# EAGLE design untitled (EAGLE 9.6.2)
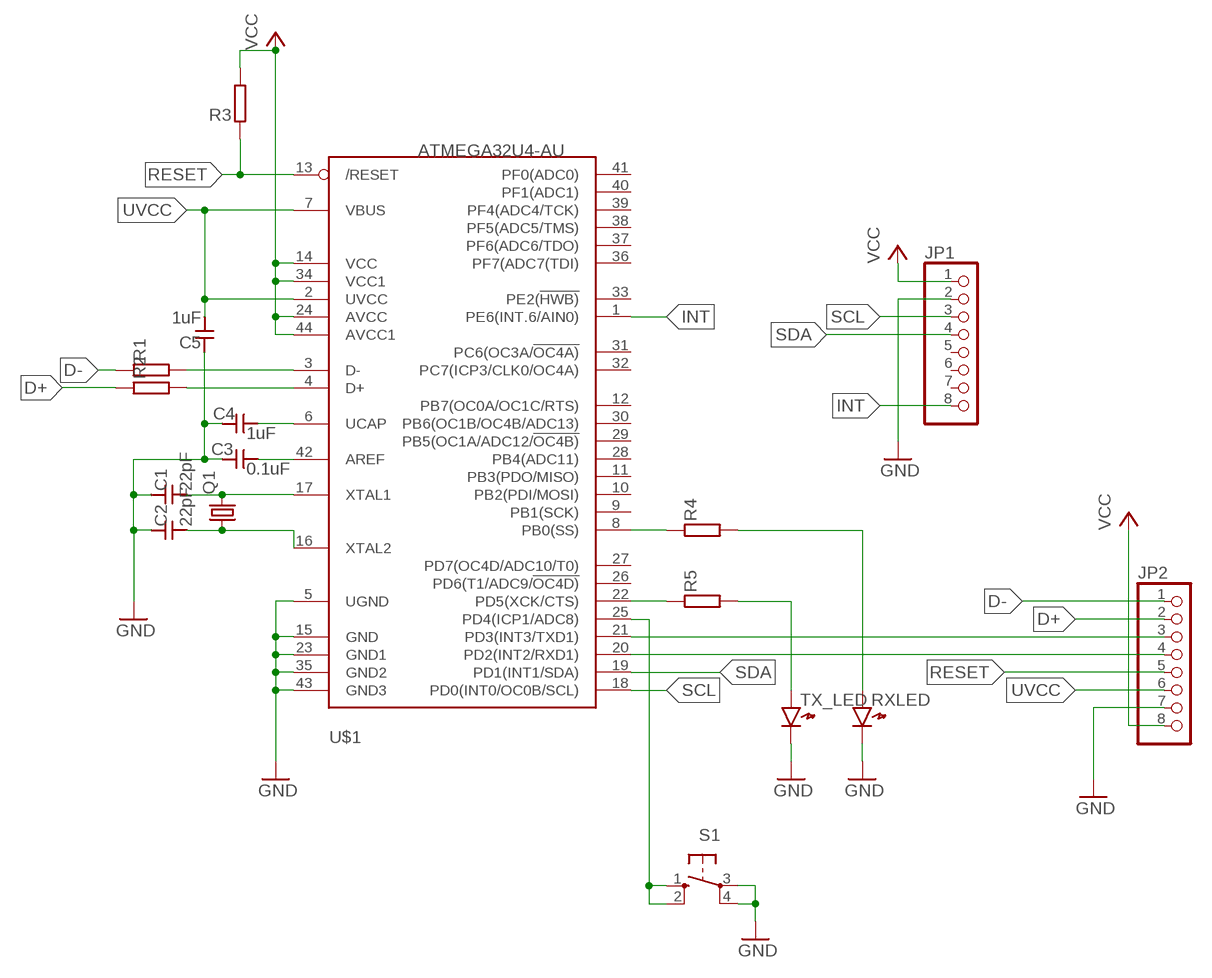
[diagram p0: schematic, sheet 1]

## Parts
C1  22pF  CAPACITOR1608  [SMD1608]
C2  22pF  CAPACITOR1608  [SMD1608]
C3  0.1uF  CAPACITOR1608  [SMD1608]
C4  1uF  CAPACITOR1608  [SMD1608]
C5  1uF  CAPACITOR1608  [SMD1608]
JP1  PINHD-1X8  [1X08]
JP2  PINHD-1X8  [1X08]
Q1  CRYSTALHC49S  [HC49/S]
R1  RESISTOR1608  [SMD1608]
R2  RESISTOR1608  [SMD1608]
R3  RESISTOR1608  [SMD1608]
R4  RESISTOR1608  [SMD1608]
R5  RESISTOR1608  [SMD1608]
RXLED  LED1608  [LED1608]
S1  10-XX  [B3F-10XX]
TX_LED  LED1608  [LED1608]
U$1  ATMEGA32U4-AU  [TQFP44]

## Nets
D+: JP2.2 R2.1
D-: JP2.1 R1.1
GND: C1.1 C2.1 C3.1 C4.1 C5.1 JP1.2 JP2.7 RXLED.K S1.3(P) S1.4(P1) TX_LED.K U$1.5(UGND) U$1.15(GND) U$1.23(GND1) U$1.35(GND2) U$1.43(GND3)
INT: JP1.8 U$1.1(PE6(INT.6/AIN0))
N$1: C1.2 Q1.2 U$1.17(XTAL1)
N$2: C2.2 Q1.1 U$1.16(XTAL2)
N$3: C4.2 U$1.6(UCAP)
N$4: C3.2 U$1.42(AREF)
N$5: S1.1(S) S1.2(S1) U$1.25(PD4(ICP1/ADC8))
N$6: R4.1 U$1.8(PB0(SS))
N$7: R5.1 U$1.22(PD5(XCK/CTS))
N$8: R1.2 U$1.3(D-)
N$9: R2.2 U$1.4(D+)
N$10: R5.2 TX_LED.A
N$11: R4.2 RXLED.A
N$13: JP2.3 U$1.21(PD3(INT3/TXD1))
N$14: JP2.4 U$1.20(PD2(INT2/RXD1))
RESET: JP2.5 R3.1 U$1.13(/RESET)
SCL: JP1.3 U$1.18(PD0(INT0/OC0B/SCL))
SDA: JP1.4 U$1.19(PD1(INT1/SDA))
UVCC: C5.2 JP2.6 U$1.2(UVCC) U$1.7(VBUS)
VCC: JP1.1 JP2.8 R3.2 U$1.14(VCC) U$1.24(AVCC) U$1.34(VCC1) U$1.44(AVCC1)
Unconnected: JP1.5 JP1.6 JP1.7 U$1.9(PB1(SCK)) U$1.10(PB2(PDI/MOSI)) U$1.11(PB3(PDO/MISO)) U$1.12(PB7(OC0A/OC1C/RTS)) U$1.26(PD6(T1/ADC9/!OC4D)) U$1.27(PD7(OC4D/ADC10/T0)) U$1.28(PB4(ADC11)) U$1.29(PB5(OC1A/ADC12/!OC4B)) U$1.30(PB6(OC1B/OC4B/ADC13)) U$1.31(PC6(OC3A/!OC4A)) U$1.32(PC7(ICP3/CLK0/OC4A)) U$1.33(PE2(!HWB)) U$1.36(PF7(ADC7(TDI)) U$1.37(PF6(ADC6/TDO)) U$1.38(PF5(ADC5/TMS)) U$1.39(PF4(ADC4/TCK)) U$1.40(PF1(ADC1)) U$1.41(PF0(ADC0))

## Library data of the parts
C1-C5 = generic:CAPACITOR: Generic Capacitor
JP1 JP2 = pinhead:PINHD-1X8: PIN HEADER
Q1 = crystal:CRYSTAL: CRYSTAL; OC_FARNELL: 1667008; OC_NEWARK: unknown
R1-R5 = generic:RESISTOR: Generic Registor
RXLED TX_LED = generic:LED: Generic LEDs
S1 = switch-omron:10-XX: OMRON SWITCH; MPN: B3F-1000; OC_FARNELL: 176432; OC_NEWARK: 36M3542
U$1 = adafruit:ATMEGA32U4: http://www.ladyada.net/library/eagle

## Board
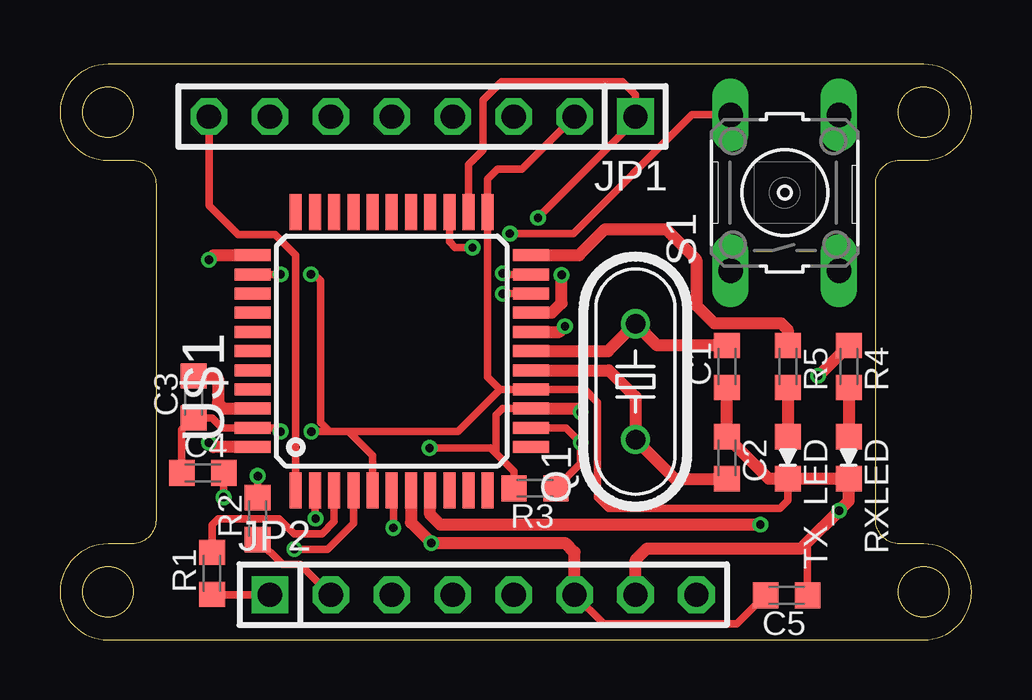
[diagram p1: board, top side]
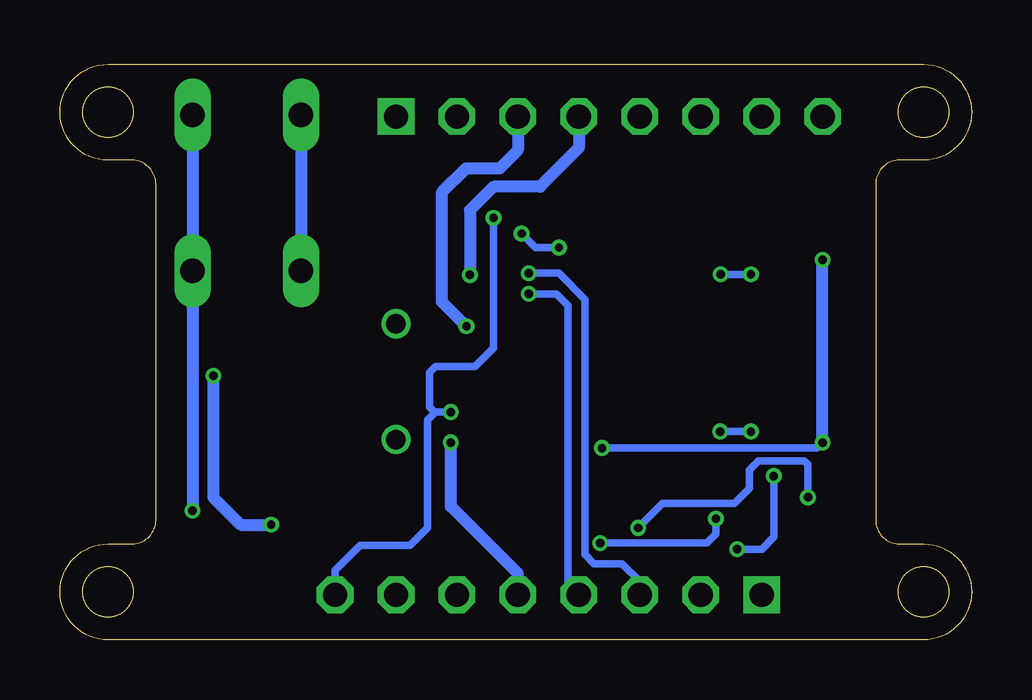
[diagram p2: board, bottom side, seen from below]

Size 38 x 24 mm. Coordinates in mm from the lower left corner, seen from the top.
Outline: 34,5 34,19 arc-90 35,20 36,20 arc180 36,24 2,24 arc180 2,20 3,20 arc-90 4,19 4,5 arc-90 3,4 2,4 arc180 2,0 36,0 arc180 36,4 35,4 arc-90 34,5
Outline: circle at 36,22 radius 1.05
Outline: circle at 2,22 radius 1.05
Outline: circle at 2,2 radius 1.05
Outline: circle at 36,2 radius 1.05
Copper layers (1*16): Top 0.035mm / dielectric 1.2mm / Bottom 0.035mm
Design rules "Elecrow_2-layer_PCB_eagle_rule *": minimum track width 6mil, minimum drill 12mil, track to track 6mil, track to pad 6mil, pad to pad 6mil, via to via 8mil, smd to smd 0mil, copper to edge 20mil, drill to drill 10mil, minimum pad ring 6mil, minimum via ring 6mil, stop-mask expansion 0mil, vias tented up to drill 100mil, thermal gap 10mil

### Footprints (pad centres in the part's own frame; a part is rotated, then mirrored left to right if it is on the bottom)
SMD1608 = smd 1.05 x 1.08: 1 -0.875,0; 2 0.875,0
1X08 = drill 1.016 square: 1 -8.89,0 | drill 1.016 octagon: 2 -6.35,0; 3 -3.81,0; 4 -1.27,0; 5 1.27,0; 6 3.81,0; 7 6.35,0; 8 8.89,0
HC49/S = drill 0.813: 1 -2.413,0; 2 2.413,0
LED1608 = smd 1.05 x 1.08: A -0.875,0; K 0.875,0
B3F-10XX = drill 1.016 long: 1 -3.251,2.261; 2 3.251,2.261; 3 -3.251,-2.261; 4 3.251,-2.261
TQFP44 = smd 1.5 x 0.5: 1 -5.8,4; 2 -5.8,3.2; 3 -5.8,2.4; 4 -5.8,1.6; 5 -5.8,0.8; 6 -5.8,0; 7 -5.8,-0.8; 8 -5.8,-1.6; 9 -5.8,-2.4; 10 -5.8,-3.2; 11 -5.8,-4; 23 5.8,-4; 24 5.8,-3.2; 25 5.8,-2.4; 26 5.8,-1.6; 27 5.8,-0.8; 28 5.8,0; 29 5.8,0.8; 30 5.8,1.6; 31 5.8,2.4; 32 5.8,3.2; 33 5.8,4 | smd 0.5 x 1.5: 12 -4,-5.8; 13 -3.2,-5.8; 14 -2.4,-5.8; 15 -1.6,-5.8; 16 -0.8,-5.8; 17 0,-5.8; 18 0.8,-5.8; 19 1.6,-5.8; 20 2.4,-5.8; 21 3.2,-5.8; 22 4,-5.8; 34 4,5.8; 35 3.2,5.8; 36 2.4,5.8; 37 1.6,5.8; 38 0.8,5.8; 39 0,5.8; 40 -0.8,5.8; 41 -1.6,5.8; 42 -2.4,5.8; 43 -3.2,5.8; 44 -4,5.8

### Placement (x,y rotation side)
C1  27.8,11.4 90 top
C2  27.8,7.59 270 top
C3  5.57,10.13 90 top
C4  5.96,6.96 0 top
C5  30.29,1.85 180 top
JP1  15.1,21.82 180 top
JP2  17.64,1.88 0 top
Q1  23.99,10.77 90 top
R1  6.34,2.77 90 top
R2  8.24,5.05 90 top
R3  19.8,6.32 180 top
R4  32.88,11.4 270 top
R5  30.34,11.4 270 top
RXLED  32.88,7.59 270 top
S1  30.21,18.64 90 top
TX_LED  30.34,7.59 270 top
U$1  13.83,12.04 90 top

### Tracks (layer width: path | path; a pad name or v marks a point on that pad's centre or on a via)
D+
  Top 0.305: R2.1 9.27,3.15 10.02,3.15 JP2.2
D-
  Top 0.305: JP2.1 6.35,1.88 R1.1
GND  (via drill 0.35)
  Top 0.305: C4.1 5.08,8.77 C3.1 6.35,9.26 6.77,8.84 U$1.43 9.04,8.84 v9.2,8.69 | C5.1 31.16,4.08 | JP1.2 19.27,19.63 18.25,19.63 17.83,19.21 U$1.23 17.83,10.96 18.35,10.44 | 18.35,10.44 U$1.15 21.88,10.44 22.41,9.91 22.41,5.94 22.87,5.49 30.01,5.49 30.34,5.82 TX_LED.K | v10.46,15.24 10.6,15.24 10.86,14.99 10.86,9.07 11.24,8.69 | v9.2,15.24 U$1.35 | U$1.5 13.03,7.68 12.03,8.69 | 11.24,8.69 v10.48,8.69 | 11.24,8.69 12.03,8.69 | 12.03,8.69 16.6,8.69 18.35,10.44
  Top 0.508: C1.1 C2.1 29.55,6.72 TX_LED.K RXLED.K 32.88,5.79 v32.47,5.38 31.16,4.08 30.9,3.81 24.47,3.81 23.99,3.33 JP2.7
  Bottom 0.305: v9.2,8.69 v10.48,8.69 | v10.46,15.24 v9.2,15.24
  Bottom 0.508: S1.4 S1.3 v32.47,5.38
INT
  Top 0.305: JP1.8 6.21,18.11 7.43,16.89 8.98,16.89 9.83,16.04 U$1.1
N$1
  Top 0.508: C1.2 24.89,12.28 Q1.2 22.85,12.04 U$1.17
N$2
  Top 0.508: C2.2 25.63,6.72 Q1.1 23.99,10.13 22.89,11.24 U$1.16
N$3  (via drill 0.35)
  Top 0.305: v13.9,4.67 13.9,6.17 U$1.6 | C4.2 6.83,5.96 v6.82,5.94
  Bottom 0.305: v13.9,4.67 12.88,5.69 9.9,5.69 9.26,6.33 9.26,7.09 8.88,7.46 6.97,7.46 6.82,7.32 v6.82,5.94
N$4
  Top 0.508: C3.2 6.48,11.01 6.59,10.9 6.59,9.88 6.83,9.64 U$1.42
N$5  (via drill 0.35)
  Top 0.305: U$1.25 16.23,16.6 16.47,16.36 v17.2,16.36 | v18.76,16.94 21.4,16.94 26.35,21.89 S1.2
  Bottom 0.305: v17.2,16.36 18.17,16.36 v18.76,16.94
  Bottom 0.508: S1.2 S1.1
N$6  (via drill 0.35)
  Top 0.508: R4.1 v31.61,11.01 | U$1.8 15.43,5.23 15.86,4.8 v29.2,4.8
  Bottom 0.508: v31.61,11.01 31.61,5.94 30.47,4.8 v29.2,4.8
N$7
  Top 0.508: U$1.22 21.64,16.04 22.72,17.12 25.26,17.12 26.53,15.85 26.53,13.95 27.26,13.21 30.06,13.21 30.34,12.93 R5.1
N$8
  Top 0.305: U$1.3 11.43,4.94 10.92,4.42 10.02,4.42 9.77,4.42 9.13,5.05 6.59,5.05 6.34,4.8 R1.2
N$9  (via drill 0.35)
  Top 0.305: U$1.4 12.23,4.85 11.16,3.79 v9.77,3.79 | v8.24,6.83 R2.2
  Bottom 0.305: v9.77,3.79 8.75,3.79 8.24,4.29 v8.24,6.83
N$10
  Top 0.508: R5.2 TX_LED.A
N$11
  Top 0.508: R4.2 RXLED.A
N$13  (via drill 0.35)
  Top 0.305: U$1.21 18.51,15.24 v18.46,15.29
  Bottom 0.305: JP2.3 13.83,2.44 14.57,3.17 15.73,3.17 16.12,3.56 16.12,14.2 17.2,15.29 v18.46,15.29
N$14  (via drill 0.35)
  Top 0.305: v18.46,14.43 18.47,14.44 U$1.20
  Bottom 0.305: JP2.4 16.83,2.34 16.83,13.95 17.31,14.43 v18.46,14.43
RESET  (via drill 0.35)
  Top 0.305: R3.1 21.7,7.36 v21.7,8.23 21.09,8.84 U$1.13
  Bottom 0.508: v21.7,8.23 21.7,5.56 18.91,2.77 JP2.5
SCL  (via drill 0.35)
  Top 0.508: U$1.18 20.82,12.84 v21.05,13.07
  Bottom 0.508: v21.05,13.07 22.09,14.11 22.09,18.64 21.07,19.66 19.67,19.66 18.91,20.42 JP1.3
SDA  (via drill 0.35)
  Top 0.508: U$1.19 20.51,13.64 20.91,14.04 v20.91,15.21
  Bottom 0.508: JP1.4 16.37,20.52 17.99,18.9 19.93,18.9 20.91,17.91 v20.91,15.21
UVCC  (via drill 0.35)
  Top 0.305: U$1.2 10.63,5.08 v10.66,5.05 | JP2.6 22.67,0.66 28.22,0.66 C5.2
  Top 0.508: U$1.7 14.63,4.89 v15.48,4.04 21.07,4.04 21.45,3.66 JP2.6
  Bottom 0.305: v10.66,5.05 10.66,4.42 11.04,4.04 v15.48,4.04
VCC  (via drill 0.35)
  Top 0.305: R3.2 18.92,7.02 18.17,7.77 | U$1.14 18.44,9.64 18.17,9.37 18.17,7.77 | v19.93,17.6 23.99,21.67 JP1.1 23.99,22.73 23.46,23.27 18.4,23.27 17.64,22.5 17.64,20.42 17.03,19.81 U$1.24 | v15.4,8 17.95,8 18.17,7.77
  Top 0.508: v21.7,9.5 21.56,9.64 U$1.14 | U$1.44 6.4,8.04 v6.21,8.23 | v6.21,15.85 6.4,16.04 U$1.34
  Bottom 0.305: JP2.8 26.53,2.9 25.49,3.94 23.41,3.94 22.67,4.67 22.67,9.17 22.36,9.47 | 22.36,9.47 22.34,9.5 v21.7,9.5 | 22.36,9.47 22.59,9.7 22.59,11.15 22.34,11.4 20.69,11.4 19.93,12.17 v19.93,17.6 | v6.21,8.23 6.44,8 v15.4,8
  Bottom 0.508: v6.21,8.23 v6.21,15.85